# Altium schematic sheet MCU.SchDoc
size A
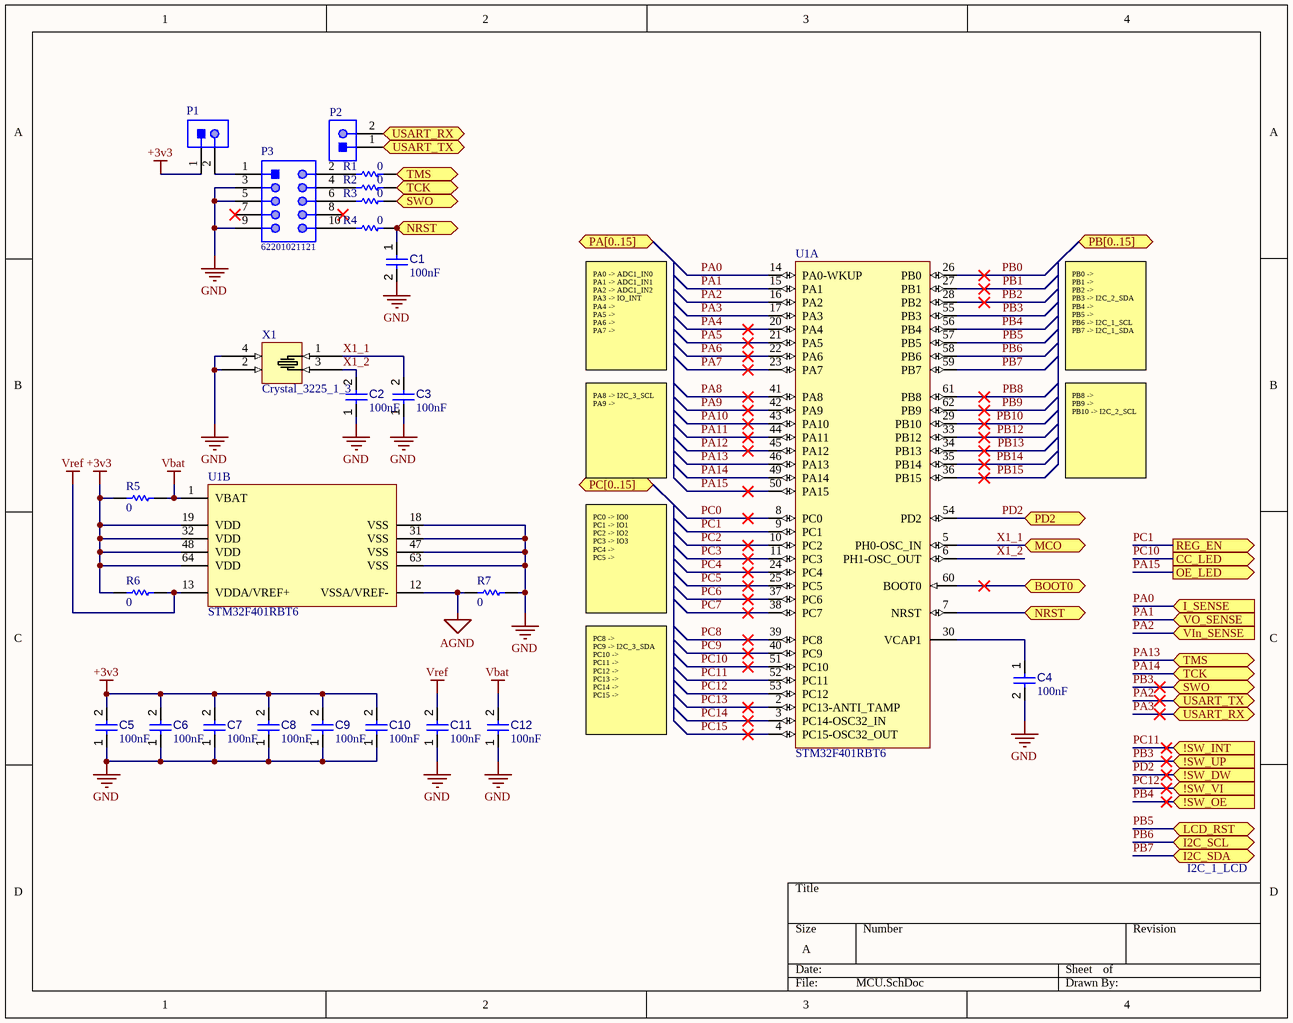
[diagram p0: MCU.SchDoc]

## Parts
C1  value 100nF  [CAPC2013X95X50ML10T25]  (hidden comment: Capacitor 100 nF +/-10% 50 V 0805)
C2  value 100nF  [CAPC2013X95X50ML10T25]  (hidden comment: Capacitor 100 nF +/-10% 50 V 0805)
C3  value 100nF  [CAPC2013X95X50ML10T25]  (hidden comment: Capacitor 100 nF +/-10% 50 V 0805)
C4  value 100nF  [CAPC2013X95X50ML10T25]  (hidden comment: Capacitor 100 nF +/-10% 50 V 0805)
C5  value 100nF  [CAPC2013X95X50ML10T25]  (hidden comment: Capacitor 100 nF +/-10% 50 V 0805)
C6  value 100nF  [CAPC2013X95X50ML10T25]  (hidden comment: Capacitor 100 nF +/-10% 50 V 0805)
C7  value 100nF  [CAPC2013X95X50ML10T25]  (hidden comment: Capacitor 100 nF +/-10% 50 V 0805)
C8  value 100nF  [CAPC2013X95X50ML10T25]  (hidden comment: Capacitor 100 nF +/-10% 50 V 0805)
C9  value 100nF  [CAPC2013X95X50ML10T25]  (hidden comment: Capacitor 100 nF +/-10% 50 V 0805)
C10  value 100nF  [CAPC2013X95X50ML10T25]  (hidden comment: Capacitor 100 nF +/-10% 50 V 0805)
C11  value 100nF  [CAPC2013X95X50ML10T25]  (hidden comment: Capacitor 100 nF +/-10% 50 V 0805)
C12  value 100nF  [CAPC2013X95X50ML10T25]  (hidden comment: Capacitor 100 nF +/-10% 50 V 0805)
P1  61300211121  [61300211121]  (value not drawn)
P2  61300211121  [61300211121]  (value not drawn)
P3  62201021121  [62201021121]
R1  value 0  [RESC2013X50X35ML15T15]  (hidden comment: Resistor 0R +/- 1% 0805 125 mW)
R2  value 0  [RESC2013X50X35ML15T15]  (hidden comment: Resistor 0R +/- 1% 0805 125 mW)
R3  value 0  [RESC2013X50X35ML15T15]  (hidden comment: Resistor 0R +/- 1% 0805 125 mW)
R4  value 0  [RESC2013X50X35ML15T15]  (hidden comment: Resistor 0R +/- 1% 0805 125 mW)
R5  value 0  [RESC2013X50X35ML15T15]  (hidden comment: Resistor 0R +/- 1% 0805 125 mW)
R6  value 0  [RESC2013X50X35ML15T15]  (hidden comment: Resistor 0R +/- 1% 0805 125 mW)
R7  value 0  [RESC2013X50X35ML15T15]  (hidden comment: Resistor 0R +/- 1% 0805 125 mW)
U1  STM32F401RBT6  [STM-LQFP64_N]  (parts A,B of 2)
X1  Crystal_3225_1_3  [Crystal_3225_1_3-Footprint-1]

## Ports
!SW_DW (in), !SW_INT (in), !SW_OE (in), !SW_UP (in), !SW_VI (in), BOOT0 (bidir), CC_LED (out), I2C_SCL (bidir), I2C_SDA (bidir), I_SENSE (in), LCD_RST (bidir), MCO (bidir), NRST (bidir), OE_LED (out), PA[0..15] (bidir), PB[0..15] (bidir), PC[0..15] (bidir), PD2 (bidir), REG_EN (out), SWO (bidir), TCK (bidir), TMS (bidir), USART_RX (bidir), USART_TX (bidir), VIn_SENSE (in), VO_SENSE (in)

## Nets
+3v3: C5.2 C6.2 C7.2 C8.2 C9.2 C10.2 P1.1 R5.1 R6.1 U1.19(VDD) U1.32(VDD) U1.48(VDD) U1.64(VDD)
AGND: R7.1 U1.12(VSSA/VREF-)
GND: C1.2 C2.1 C3.1 C4.2 C5.1 C6.1 C7.1 C8.1 C9.1 C10.1 C11.1 C12.1 P3.3 P3.5 P3.9 R7.2 U1.18(VSS) U1.31(VSS) U1.47(VSS) U1.63(VSS) X1.2(GND) X1.4(GND)
Vbat: C12.2 R5.2 U1.1(VBAT)
Vref: C11.2 R6.2 U1.13(VDDA/VREF+)
BOOT0: U1.60(BOOT0) ; port BOOT0
NRST: C1.1 R4.2 U1.7(NRST) ; port NRST
PA0: U1.14(PA0-WKUP) ; port I_SENSE
PA1: U1.15(PA1) ; port VO_SENSE
PA2: P2.1 U1.16(PA2) ; port USART_TX, port VIn_SENSE
PA3: P2.2 U1.17(PA3) ; port USART_RX
PA4: U1.20(PA4)
PA5: U1.21(PA5)
PA6: U1.22(PA6)
PA7: U1.23(PA7)
PA8: U1.41(PA8)
PA9: U1.42(PA9)
PA10: U1.43(PA10)
PA11: U1.44(PA11)
PA12: U1.45(PA12)
PA13: R1.2 U1.46(PA13) ; port TMS
PA14: R2.2 U1.49(PA14) ; port TCK
PA15: U1.50(PA15) ; port OE_LED
PB0: U1.26(PB0)
PB1: U1.27(PB1)
PB2: U1.28(PB2)
PB3: R3.2 U1.55(PB3) ; port SWO, port !SW_UP
PB4: U1.56(PB4) ; port !SW_OE
PB5: U1.57(PB5) ; port LCD_RST
PB6: U1.58(PB6) ; port I2C_SCL
PB7: U1.59(PB7) ; port I2C_SDA
PB8: U1.61(PB8)
PB9: U1.62(PB9)
PB10: U1.29(PB10)
PB12: U1.33(PB12)
PB13: U1.34(PB13)
PB14: U1.35(PB14)
PB15: U1.36(PB15)
PC0: U1.8(PC0)
PC1: U1.9(PC1) ; port REG_EN
PC2: U1.10(PC2)
PC3: U1.11(PC3)
PC4: U1.24(PC4)
PC5: U1.25(PC5)
PC6: U1.37(PC6)
PC7: U1.38(PC7)
PC8: U1.39(PC8)
PC9: U1.40(PC9)
PC10: U1.51(PC10) ; port CC_LED
PC11: U1.52(PC11) ; port !SW_INT
PC12: U1.53(PC12) ; port !SW_VI
PC13: U1.2(PC13-ANTI_TAMP)
PC14: U1.3(PC14-OSC32_IN)
PC15: U1.4(PC15-OSC32_OUT)
PD2: U1.54(PD2) ; port PD2, port !SW_DW
X1_1: C3.2 U1.5(PH0-OSC_IN) X1.1(X1) ; port MCO
X1_2: C2.2 U1.6(PH1-OSC_OUT) X1.3(X2)
NetC4_1: C4.1 U1.30(VCAP1)
NetP1_2: P1.2 P3.1
NetP3_2: P3.2 R1.1
NetP3_4: P3.4 R2.1
NetP3_6: P3.6 R3.1
NetP3_10: P3.10 R4.1

Not connected (* = marked no-connect by the designer): P3 7* 8*

## Notes on the sheet
- PA0 -> ADC1_IN0
  PA1 -> ADC1_IN1
  PA2 -> ADC1_IN2
  PA3 -> IO_INT
  PA4 ->
  PA5 ->
  PA6 ->
  PA7 ->
- PB0 ->
  PB1 ->
  PB2 ->
  PB3 -> I2C_2_SDA
  PB4 ->
  PB5 ->
  PB6 -> I2C_1_SCL
  PB7 -> I2C_1_SDA
- PA8 -> I2C_3_SCL
  PA9 ->
- PB8 ->
  PB9 ->
  PB10 -> I2C_2_SCL
- PC0 -> IO0
  PC1 -> IO1
  PC2 -> IO2
  PC3 -> IO3
  PC4 ->
  PC5 ->
- PC8 ->
  PC9 -> I2C_3_SDA
  PC10 ->
  PC11 ->
  PC12 ->
  PC13 ->
  PC14 ->
  PC15 ->
- I2C_1_LCD

## Library data of the parts
C1-C12 = CMP-001-00018-4: Chip Capacitor, 100 nF, +/- 10%, 50 V, 0805 (2012 Metric); Voltage Rating: 50V; Capacitor Type: Ceramic; RoHS Compliant: True; Max Operating Temperature: 125°C; Mounting Technology: SM; Case/Package: 0805; Tolerance: 10%; Min Operating Temperature: -55°C; Pins: 2
P1 P2 = CMP-1502-01060-1: THT Vertical Pin Header WR-PHD, Pitch 2.54 mm, Single Row, 2 pins; Manufacturer: Wurth Elektronik; Rated Current: 3A; Gender: Male; Withstanding Voltage: 500VAC; Working Voltage: 250VAC; Pitch: 2.54mm; Contact Resistance: 20mOhm; Pin Number: 2; Mounting Technology: THT; Orientation: Vertical; Operating Temperature: -40to105degC; Packaging: Bag; Publisher: WurthElektronik; Datasheet URL: https://katalog.we-online.de/em/datasheet/6130xx11121.pdf; Manufacturer URL: http://www.we-online.de; Row Number: Single; Package Reference: 61300211121; Part Number: 61300211121
P3 = CMP-1502-00948-1: THT Vertical Pin Header WR-PHD, Pitch 1.27 mm, Dual Row, 10 pins; Manufacturer: Wurth Elektronik; Rated Current: 1A; Pin Number: 10; Working Voltage: 100VAC; Contact Resistance: 20mOhm; Withstanding Voltage: 500VAC; Pitch: 1.27mm; Gender: Male; Mounting Technology: THT; Manufacturer URL: http://www.we-online.de; Package Reference: 62201021121; Row Number: Dual; Datasheet URL: https://katalog.we-online.de/em/datasheet/62201021121.pdf; Publisher: WurthElektronik; Packaging: Box; Operating Temperature: -40to105degC; Orientation: Vertical; Part Number: 62201021121
R1-R7 = CMP-009-00001-4: Chip Resistor, 0 Ohm, +/- 1%, 125 mW, -55 to 155 degC, 0805 (2012 Metric); Power: 125mW; Voltage Rating: 150V; Tolerance: 1%; Mounting Technology: SM; Min Operating Temperature: -55°C; Case/Package: 0805; Pins: 2; Max Operating Temperature: 155°C; RoHS Compliant: True
U1 = CMP-0243-00094-2: ARM Cortex-M4 32-bit MCU+FPU, 105 DMIPS, 128 kB Flash, 64 kB Internal RAM, 48 I/Os, 64-pin LQFP, -40 to 85 degC, Tray; Manufacturer: STMicroelectronics; Internal RAM Size (kB): 64; FLASH Size (Prog) (kB): 128; Supply Voltage(Vcc) max (V): 3.6; I/Os (High Current): 48; Supply Voltage(Vcc) min (V): 1.8; Operating Frequency(F) (Processor speed) (MHz): 84; Core: ARM Cortex-M4; PackageDescription: 64-Pin Low Profile Quad Flat Package, 10 x 10 mm Body, 0.5 mm Pitch; Mounting Technology: Surface Mount; PackageVersion: Rev. 4, 06/2013; ComponentLink1URL: http://www.st.com/web/en/home.html; ComponentLink3Description: Package Specification; ComponentLink2Description: Datasheet; ComponentLink3URL: http://www.st.com/st-web-ui/static/active/en/resource/technical/document/datasheet/DM00037051.pdf; ComponentLink2URL: http://www.st.com/st-web-ui/static/active/en/resource/technical/document/data_brief/DM00071938.pdf; DatasheetVersion: Rev. 1; Packing: Tray; PackageReference: LQFP64; PartNumber: STM32F401RBT6; ComponentLink1Description: Manufacturer URL
X1 = CMP-003-00030-1: 3225 crystal